# EAGLE schematic Lab_1_3 (EAGLE 7.4.0)
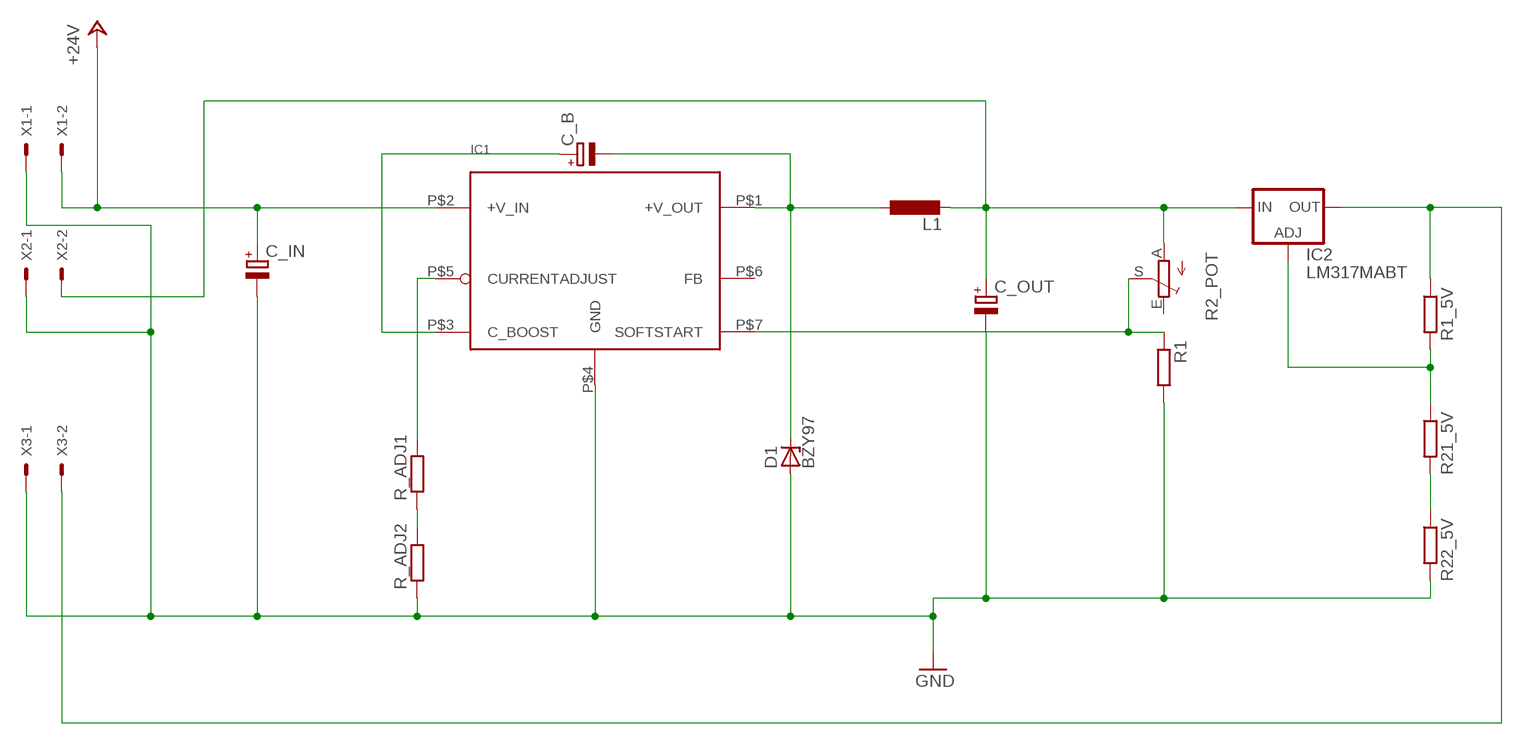
[diagram p0: schematic, sheet 1]

## Parts
C_B  CPOL-EUETR2  [ETR2]
C_IN  CPOL-EUE5-13  [E5-13]
C_OUT  CPOL-EUE5-10.5  [E5-10,5]
D1  BZY97  [F126Z12]
IC1  LM2576-T05D  [TO220-5_STAGGERED]
IC2  LM317MABT  [TO220L1]
L1  L-EUTJ4-U2  [TJ4-U2]
R1  R-EU_0309/12  [0309/12]
R1_5V  R-EU_0309/12  [0309/12]
R2_POT  TRIM_EU-B25P  [B25P]
R21_5V  R-EU_0309/12  [0309/12]
R22_5V  R-EU_0309/12  [0309/12]
R_ADJ1  R-EU_0309/12  [0309/12]
R_ADJ2  R-EU_0309/12  [0309/12]
X1  KK-156-2  [KK-156-2]
X2  KK-156-2  [KK-156-2]
X3  KK-156-2  [KK-156-2]

## Nets
+24V: C_IN.+ IC1.P$2(+V_IN) X1.2
GND: C_IN.- C_OUT.- D1.A IC1.P$4(GND) R1.2 R22_5V.2 R_ADJ2.1 X1.1 X2.1 X3.1
N$1: IC2.1(ADJ) R1_5V.2 R21_5V.1
N$2: C_B.- D1.C IC1.P$1(+V_OUT) L1.1
N$3: C_B.+ IC1.P$3(C_BOOST)
N$4: IC1.P$7(SOFTSTART) R1.1 R2_POT.S
N$5: C_OUT.+ IC2.3(IN) L1.2 R2_POT.A X2.2
N$6: R_ADJ1.1 R_ADJ2.2
N$7: IC1.P$5(CURRENTADJUST) R_ADJ1.2
N$15: IC2.2(OUT) R1_5V.1 X3.2
N$16: R21_5V.2 R22_5V.1
Unconnected: IC1.P$6(FB) R2_POT.E

## Library data of the parts
C_B C_IN C_OUT = resistor:CPOL-EU: POLARIZED CAPACITOR, European symbol
D1 = diode:BZY97: Z DIODE
IC1 = 2673:LM2576-T05D: LM2673/LM2673HV Series SIMPLE SWITCHER® 3A Step-Down Voltage Regulator STAGGERED PACKAGE
IC2 = v-reg:LM317?*: 500 mA Adjustable Output Positive Voltage Regulator Source: http://www.onsemi.co.jp .. LM317M-D.PDF
L1 = resistor:L-EU: INDUCTOR, European symbol
R1 R1_5V R21_5V R22_5V R_ADJ1 R_ADJ2 = resistor:R-EU_: RESISTOR, European symbol
R2_POT = pot:TRIM_EU-: POTENTIOMETER
X1-X3 = con-molex:KK-156-2: KK 156 HEADER Source: http://www.molex.com/pdm_docs/sd/026604100_sd.pdf; OC_FARNELL: unknown; OC_NEWARK: unknown